# EAGLE schematic mysch_full (EAGLE 9.5.0)

## Sheet 1 of 3
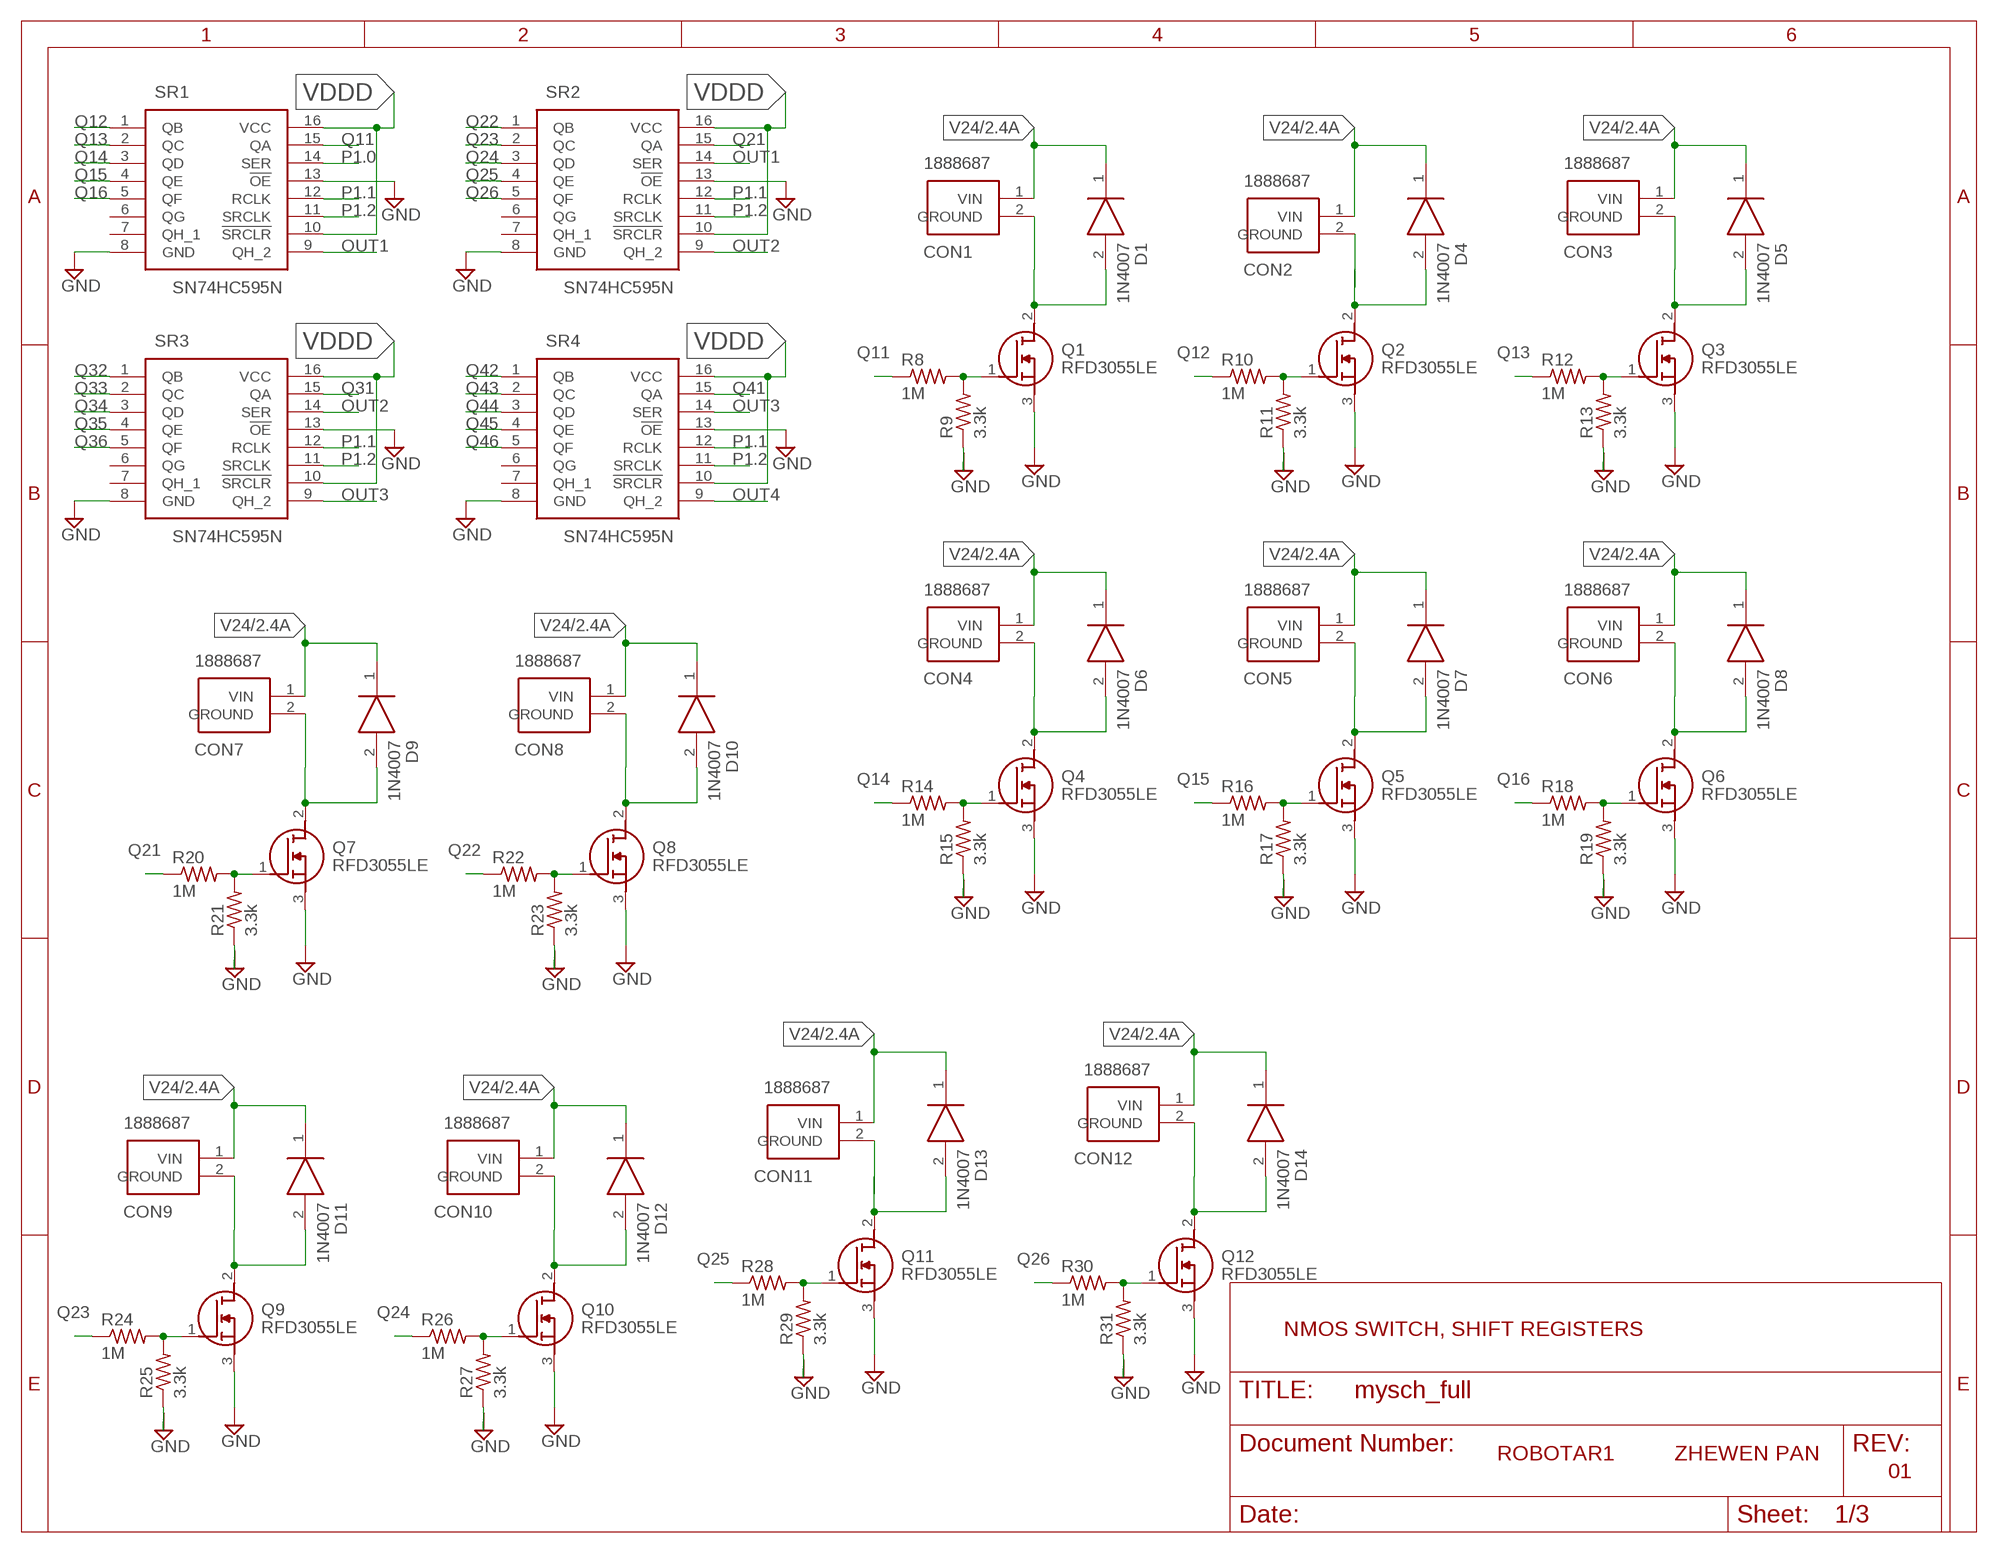
[diagram p0: schematic, sheet 1]

### Parts
CON1  1888687  [SHDR2W90P0X508_1X2_1016X950X15]
CON2  1888687  [SHDR2W90P0X508_1X2_1016X950X15]
CON3  1888687  [SHDR2W90P0X508_1X2_1016X950X15]
CON4  1888687  [SHDR2W90P0X508_1X2_1016X950X15]
CON5  1888687  [SHDR2W90P0X508_1X2_1016X950X15]
CON6  1888687  [SHDR2W90P0X508_1X2_1016X950X15]
CON7  1888687  [SHDR2W90P0X508_1X2_1016X950X15]
CON8  1888687  [SHDR2W90P0X508_1X2_1016X950X15]
CON9  1888687  [SHDR2W90P0X508_1X2_1016X950X15]
CON10  1888687  [SHDR2W90P0X508_1X2_1016X950X15]
CON11  1888687  [SHDR2W90P0X508_1X2_1016X950X15]
CON12  1888687  [SHDR2W90P0X508_1X2_1016X950X15]
D1  1N4007  [DIOAD1410W86L470D235]
D4  1N4007  [DIOAD1410W86L470D235]
D5  1N4007  [DIOAD1410W86L470D235]
D6  1N4007  [DIOAD1410W86L470D235]
D7  1N4007  [DIOAD1410W86L470D235]
D8  1N4007  [DIOAD1410W86L470D235]
D9  1N4007  [DIOAD1410W86L470D235]
D10  1N4007  [DIOAD1410W86L470D235]
D11  1N4007  [DIOAD1410W86L470D235]
D12  1N4007  [DIOAD1410W86L470D235]
D13  1N4007  [DIOAD1410W86L470D235]
D14  1N4007  [DIOAD1410W86L470D235]
Q1  RFD3055LE  [TO229P250X658X985-3P]
Q2  RFD3055LE  [TO229P250X658X985-3P]
Q3  RFD3055LE  [TO229P250X658X985-3P]
Q4  RFD3055LE  [TO229P250X658X985-3P]
Q5  RFD3055LE  [TO229P250X658X985-3P]
Q6  RFD3055LE  [TO229P250X658X985-3P]
Q7  RFD3055LE  [TO229P250X658X985-3P]
Q8  RFD3055LE  [TO229P250X658X985-3P]
Q9  RFD3055LE  [TO229P250X658X985-3P]
Q10  RFD3055LE  [TO229P250X658X985-3P]
Q11  RFD3055LE  [TO229P250X658X985-3P]
Q12  RFD3055LE  [TO229P250X658X985-3P]
R8  1M  R-US_R0805  [R0805]
R9  3.3k  R-US_R0805  [R0805]
R10  1M  R-US_R0805  [R0805]
R11  3.3k  R-US_R0805  [R0805]
R12  1M  R-US_R0805  [R0805]
R13  3.3k  R-US_R0805  [R0805]
R14  1M  R-US_R0805  [R0805]
R15  3.3k  R-US_R0805  [R0805]
R16  1M  R-US_R0805  [R0805]
R17  3.3k  R-US_R0805  [R0805]
R18  1M  R-US_R0805  [R0805]
R19  3.3k  R-US_R0805  [R0805]
R20  1M  R-US_R0805  [R0805]
R21  3.3k  R-US_R0805  [R0805]
R22  1M  R-US_R0805  [R0805]
R23  3.3k  R-US_R0805  [R0805]
R24  1M  R-US_R0805  [R0805]
R25  3.3k  R-US_R0805  [R0805]
R26  1M  R-US_R0805  [R0805]
R27  3.3k  R-US_R0805  [R0805]
R28  1M  R-US_R0805  [R0805]
R29  3.3k  R-US_R0805  [R0805]
R30  1M  R-US_R0805  [R0805]
R31  3.3k  R-US_R0805  [R0805]
SR1  SN74HC595N  [DIP794W53P254L1930H508Q16N]
SR2  SN74HC595N  [DIP794W53P254L1930H508Q16N]
SR3  SN74HC595N  [DIP794W53P254L1930H508Q16N]
SR4  SN74HC595N  [DIP794W53P254L1930H508Q16N]

### Nets
GND: Q1.3(S) Q2.3(S) Q3.3(S) Q4.3(S) Q5.3(S) Q6.3(S) Q7.3(S) Q8.3(S) Q9.3(S) Q10.3(S) Q11.3(S) Q12.3(S) R9.1 R11.1 R13.1 R15.1 R17.1 R19.1 R21.1 R23.1 R25.1 R27.1 R29.1 R31.1 SR1.8(GND) SR1.13(!OE) SR2.8(GND) SR2.13(!OE) SR3.8(GND) SR3.13(!OE) SR4.8(GND) SR4.13(!OE) ; also sheet 2,3
N$6: Q1.1(G) R8.2 R9.2
N$7: CON1.2(GROUND) D1.2(A) Q1.2(D)
N$12: D4.2(A) Q2.2(D)
N$13: Q2.1(G) R10.2 R11.2
N$15: D5.2(A) Q3.2(D)
N$16: Q3.1(G) R12.2 R13.2
N$18: D6.2(A) Q4.2(D)
N$19: Q4.1(G) R14.2 R15.2
N$21: D7.2(A) Q5.2(D)
N$22: Q5.1(G) R16.2 R17.2
N$24: D8.2(A) Q6.2(D)
N$25: Q6.1(G) R18.2 R19.2
N$27: D9.2(A) Q7.2(D)
N$28: Q7.1(G) R20.2 R21.2
N$30: D10.2(A) Q8.2(D)
N$31: Q8.1(G) R22.2 R23.2
N$33: D11.2(A) Q9.2(D)
N$34: Q9.1(G) R24.2 R25.2
N$36: D12.2(A) Q10.2(D)
N$37: Q10.1(G) R26.2 R27.2
N$39: D13.2(A) Q11.2(D)
N$40: Q11.1(G) R28.2 R29.2
N$42: D14.2(A) Q12.2(D)
N$43: Q12.1(G) R30.2 R31.2
N$80: CON2.2(GROUND)
N$81: CON3.2(GROUND)
N$82: CON4.2(GROUND)
N$83: CON5.2(GROUND)
N$84: CON6.2(GROUND)
N$85: CON7.2(GROUND)
N$86: CON8.2(GROUND)
N$87: CON9.2(GROUND)
N$88: CON10.2(GROUND)
N$89: CON11.2(GROUND)
N$90: CON12.2(GROUND)
OUT1: SR1.9(QH_2) SR2.14(SER)
OUT2: SR2.9(QH_2) SR3.14(SER)
OUT3: SR3.9(QH_2) SR4.14(SER)
OUT4: SR4.9(QH_2)
P1.0: SR1.14(SER) ; also sheet 3
P1.1: SR1.12(RCLK) SR2.12(RCLK) SR3.12(RCLK) SR4.12(RCLK) ; also sheet 3
P1.2: SR1.11(SRCLK) SR2.11(SRCLK) SR3.11(SRCLK) SR4.11(SRCLK) ; also sheet 3
Q11: R8.1 SR1.15(QA)
Q12: R10.1 SR1.1(QB)
Q13: R12.1 SR1.2(QC)
Q14: R14.1 SR1.3(QD)
Q15: R16.1 SR1.4(QE)
Q16: R18.1 SR1.5(QF)
Q21: R20.1 SR2.15(QA)
Q22: R22.1 SR2.1(QB)
Q23: R24.1 SR2.2(QC)
Q24: R26.1 SR2.3(QD)
Q25: R28.1 SR2.4(QE)
Q26: R30.1 SR2.5(QF)
Q31: SR3.15(QA) ; also sheet 2
Q32: SR3.1(QB)
Q33: SR3.2(QC)
Q34: SR3.3(QD)
Q35: SR3.4(QE)
Q36: SR3.5(QF)
Q41: SR4.15(QA)
Q42: SR4.1(QB)
Q43: SR4.2(QC)
Q44: SR4.3(QD)
Q45: SR4.4(QE)
Q46: SR4.5(QF)
V1: CON2.1(VIN)
V2: CON3.1(VIN)
V3: CON4.1(VIN)
V4: CON5.1(VIN)
V5: CON6.1(VIN)
V6: CON7.1(VIN)
V7: CON8.1(VIN)
V8: CON9.1(VIN)
V9: CON10.1(VIN)
V10: CON11.1(VIN)
V11: CON12.1(VIN)
V24: CON1.1(VIN) D1.1(K) D4.1(K) D5.1(K) D6.1(K) D7.1(K) D8.1(K) D9.1(K) D10.1(K) D11.1(K) D12.1(K) D13.1(K) D14.1(K) ; also sheet 2,3
VDDD: SR1.10(!SRCLR) SR1.16(VCC) SR2.10(!SRCLR) SR2.16(VCC) SR3.10(!SRCLR) SR3.16(VCC) SR4.10(!SRCLR) SR4.16(VCC)
Unconnected: SR1.6(QG) SR1.7(QH_1) SR2.6(QG) SR2.7(QH_1) SR3.6(QG) SR3.7(QH_1) SR4.6(QG) SR4.7(QH_1)

### Notes on the sheet
- NMOS SWITCH, SHIFT REGISTERS
- ROBOTAR1 | ZHEWEN PAN
- 01

## Sheet 2 of 3
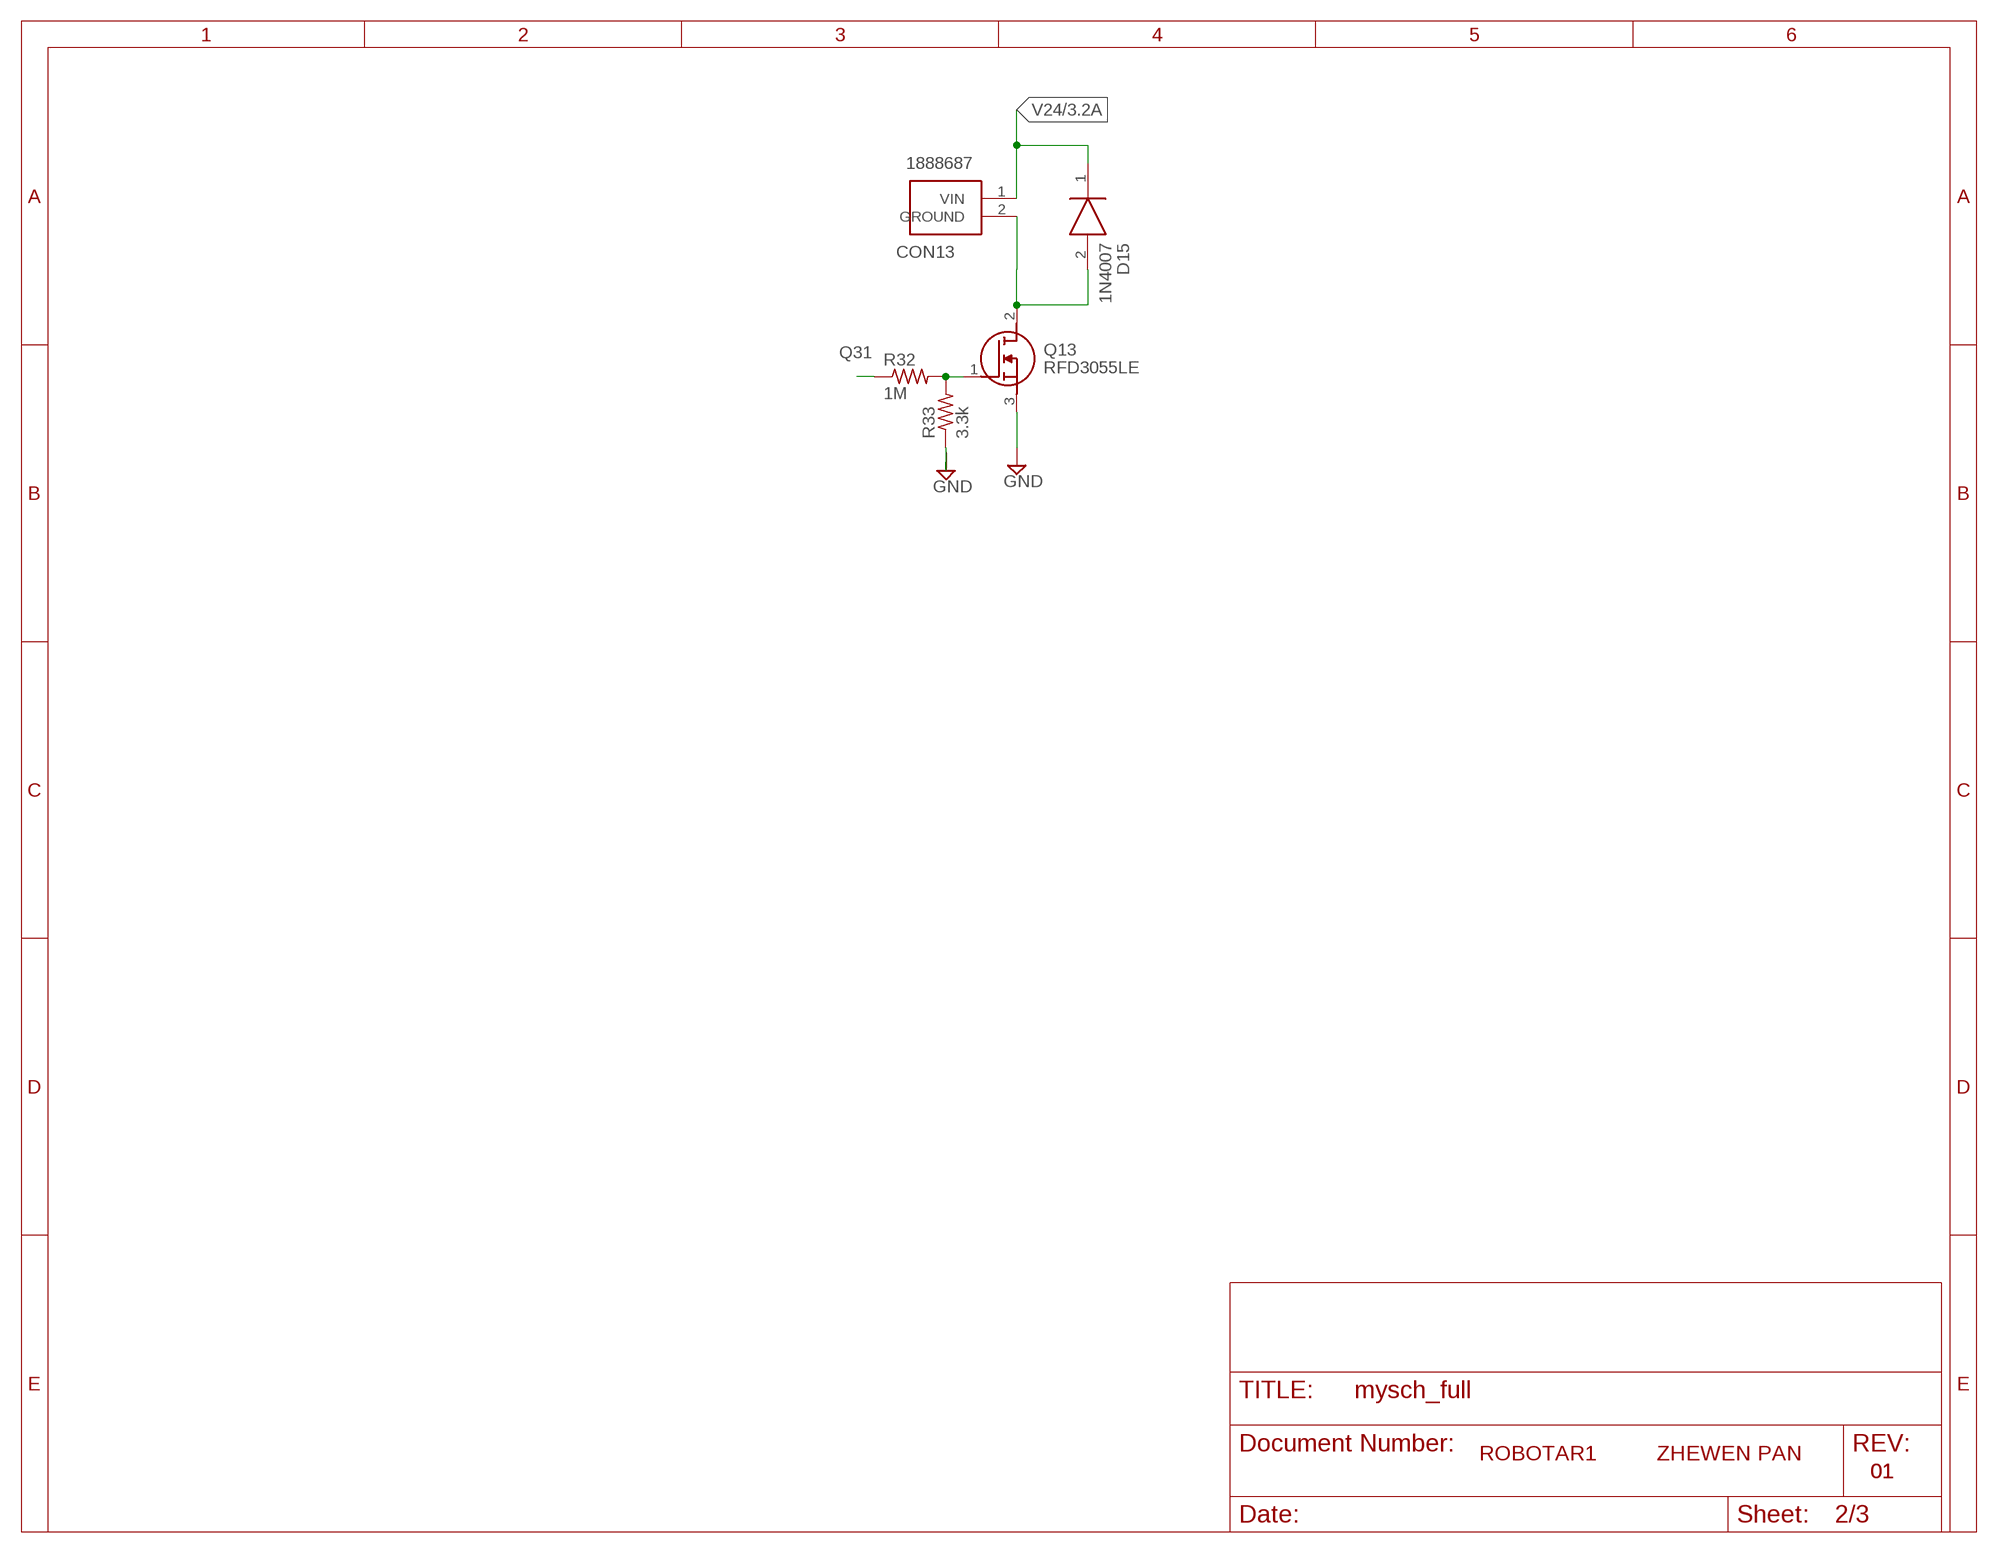
[diagram p1: schematic, sheet 2]

### Parts
CON13  1888687  [SHDR2W90P0X508_1X2_1016X950X15]
D15  1N4007  [DIOAD1410W86L470D235]
Q13  RFD3055LE  [TO229P250X658X985-3P]
R32  1M  R-US_R0805  [R0805]
R33  3.3k  R-US_R0805  [R0805]

### Nets
GND: Q13.3(S) R33.1 ; also sheet 1,3
N$9: D15.2(A) Q13.2(D)
N$45: Q13.1(G) R32.2 R33.2
N$91: CON13.2(GROUND)
Q31: R32.1 ; also sheet 1
V12: CON13.1(VIN)
V24: D15.1(K) ; also sheet 1,3

### Notes on the sheet
- ROBOTAR1 | ZHEWEN PAN
- 01 | 01

## Sheet 3 of 3
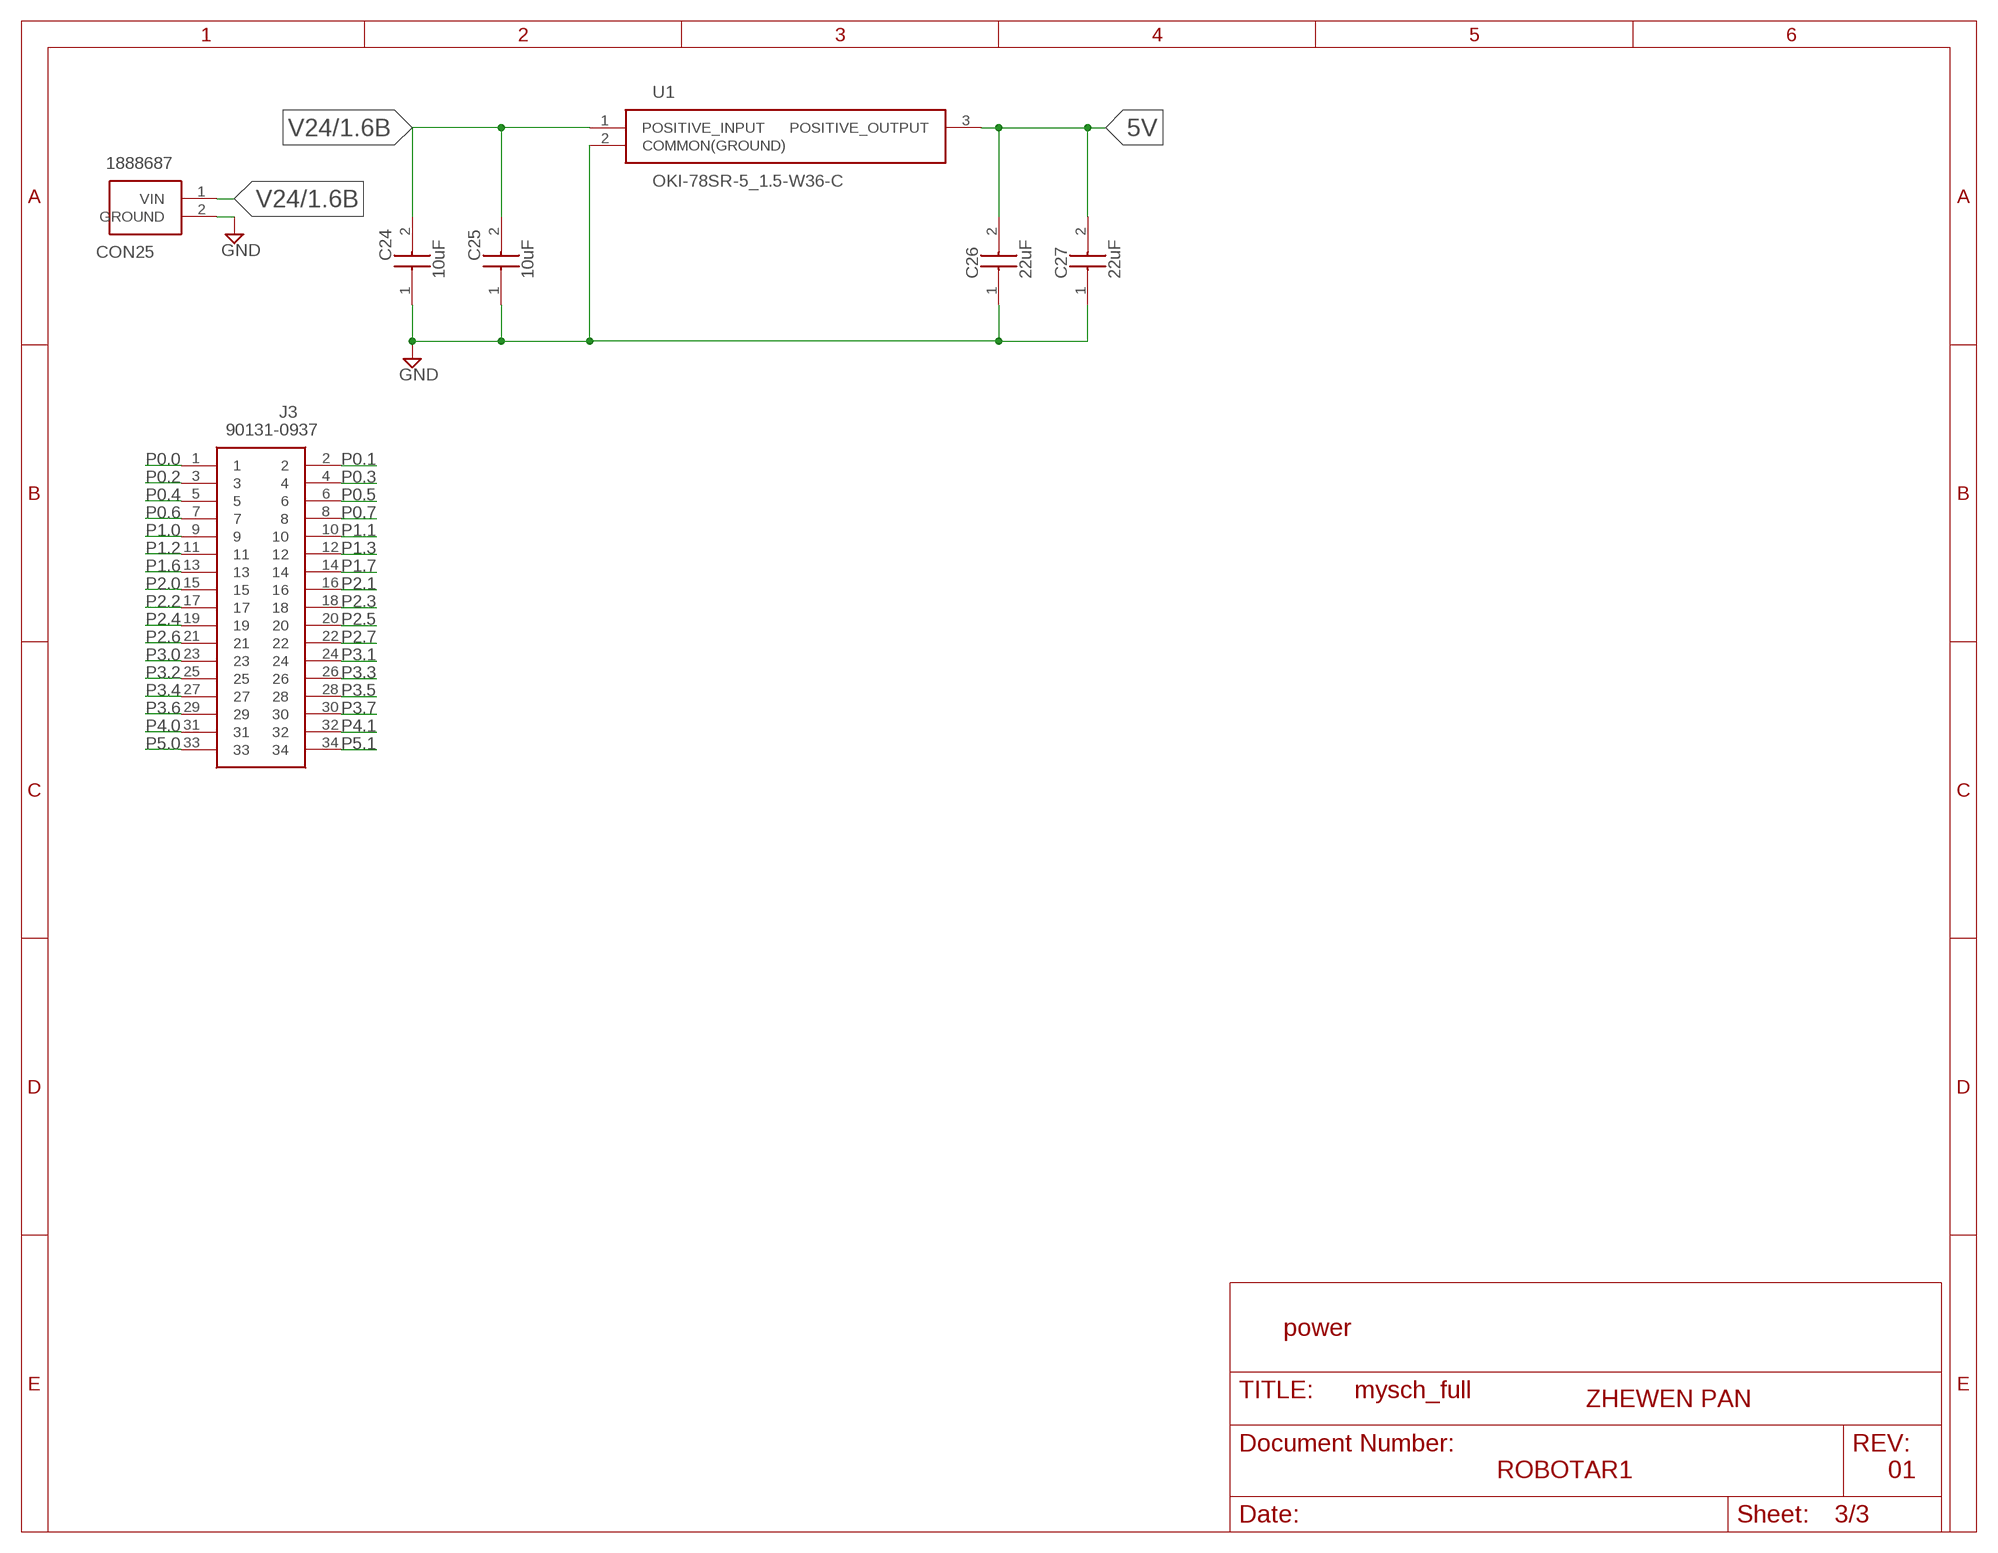
[diagram p2: schematic, sheet 3]

### Parts
C24  10uF  GRM32DF51H106ZA01K  [CAPC3225X220N]
C25  10uF  GRM32DF51H106ZA01K  [CAPC3225X220N]
C26  22uF  GRM32ER71E226KE15K  [CAPC3225X270N]
C27  22uF  GRM32ER71E226KE15K  [CAPC3225X270N]
CON25  1888687  [SHDR2W90P0X508_1X2_1016X950X15]
J3  90131-0937  [HDRV34W90P254_2X17_4308X500X56]
U1  OKI-78SR-5_1.5-W36-C  [OKI-78SR]

### Nets
5V: C26.2 C27.2 U1.3(POSITIVE_OUTPUT)
GND: C24.1 C25.1 C26.1 C27.1 CON25.2(GROUND) U1.2(COMMON(GROUND)) ; also sheet 1,2
P0.0: J3.1
P0.1: J3.2
P0.2: J3.3
P0.3: J3.4
P0.4: J3.5
P0.5: J3.6
P0.6: J3.7
P0.7: J3.8
P1.0: J3.9 ; also sheet 1
P1.1: J3.10 ; also sheet 1
P1.2: J3.11 ; also sheet 1
P1.3: J3.12
P1.6: J3.13
P1.7: J3.14
P2.0: J3.15
P2.1: J3.16
P2.2: J3.17
P2.3: J3.18
P2.4: J3.19
P2.5: J3.20
P2.6: J3.21
P2.7: J3.22
P3.0: J3.23
P3.1: J3.24
P3.2: J3.25
P3.3: J3.26
P3.4: J3.27
P3.5: J3.28
P3.6: J3.29
P3.7: J3.30
P4.0: J3.31
P4.1: J3.32
P5.0: J3.33
P5.1: J3.34
V24: C24.2 C25.2 CON25.1(VIN) U1.1(POSITIVE_INPUT) ; also sheet 1,2

### Notes on the sheet
- power
- ZHEWEN PAN
- ROBOTAR1 | 01

## Library data of the parts
C24 C25 = SamacSys_Parts:GRM32DF51H106ZA01K: Multilayer Ceramic Capacitors MLCC - SMD/SMT 10uF 50Volts -20% to 80% Source: Datasheet <http://www.murata.com/~/media/webrenewal/support/library/catalog/products/capacitor/mlcc/c02e.pdf>; DESCRIPTION: Multilayer Ceramic Capacitors MLCC - SMD/SMT 10uF 50Volts -20% to 80%; HEIGHT: 2.2mm; MANUFACTURER_NAME: Murata Electronics; MANUFACTURER_PART_NUMBER: GRM32DF51H106ZA01K
C26 C27 = SamacSys_Parts:GRM32ER71E226KE15K: Multilayer Ceramic Capacitors MLCC - SMD/SMT 22UF 25V 10% 1210 Source: Datasheet <http://psearch.en.murata.com/capacitor/product/GRM32ER71E226KE15#.pdf>; DESCRIPTION: Multilayer Ceramic Capacitors MLCC - SMD/SMT 22UF 25V 10% 1210; HEIGHT: 2.7mm; MANUFACTURER_NAME: Murata Electronics; MANUFACTURER_PART_NUMBER: GRM32ER71E226KE15K
CON1-CON13 CON25 = SamacSys_Parts:1888687: Phoenix Contact COMBICON MKDSN Series 5.08mm Pitch Straight PCB Terminal Block with Screw Termination, Through Hole Source: Datasheet <http://uk.rs-online.com/web/p/products/8045095>; ALLIED_NUMBER: 70054422; DESCRIPTION: Phoenix Contact COMBICON MKDSN Series 5.08mm Pitch Straight PCB Terminal Block with Screw Termination, Through Hole; HEIGHT: 15mm; MANUFACTURER_NAME: Phoenix Contact; MANUFACTURER_PART_NUMBER: 1888687; RS_PART_NUMBER: 8045095; RS_PRICE-STOCK: http://uk.rs-online.com/web/p/products/8045095
D1 D4-D15 = SamacSys_Parts:1N4007: MULTICOMP - 1N4007 - DIODE, STANDARD, 1A, 1000V,DO-41 Source: Datasheet; DESCRIPTION: MULTICOMP - 1N4007 - DIODE, STANDARD, 1A, 1000V,DO-41; HEIGHT: mm; MANUFACTURER_NAME: MULTICOMP; MANUFACTURER_PART_NUMBER: 1N4007
J3 = 90131-0937:90131-0937: Molex C-GRID III Series, Series Number 90131, 2.54mm Pitch 34 Way 2 Row Straight PCB Header, Solder Termination, 3A Source: Datasheet <http://uk.rs-online.com/web/p/products/6703569>; ALLIED_NUMBER: 70373750; DESCRIPTION: Molex C-GRID III Series, Series Number 90131, 2.54mm Pitch 34 Way 2 Row Straight PCB Header, Solder Termination, 3A; HEIGHT: 5.6mm; MANUFACTURER_NAME: Molex; MANUFACTURER_PART_NUMBER: 90131-0937; RS_PART_NUMBER: 6703569; RS_PRICE-STOCK: http://uk.rs-online.com/web/p/products/6703569
Q1-Q13 = SamacSys_Parts:RFD3055LE: ON SEMICONDUCTOR - RFD3055LE - MOSFET, N-CH, 60V, 11A, TO-251AA-3 Source: Datasheet <https://www.onsemi.com/pub/Collateral/RFD3055LESM-D.pdf>; DESCRIPTION: ON SEMICONDUCTOR - RFD3055LE - MOSFET, N-CH, 60V, 11A, TO-251AA-3; HEIGHT: 2.5mm; MANUFACTURER_NAME: ON Semiconductor; MANUFACTURER_PART_NUMBER: RFD3055LE
R8-R33 = rcl:R-US_: RESISTOR, American symbol; SPICEPREFIX: R
SR1-SR4 = SamacSys_Parts:SN74HC595N: 8-Bit Shift Registers With 3-State Output Registers Source: Datasheet <http://uk.rs-online.com/web/p/products/2175695P>; DESCRIPTION: 8-Bit Shift Registers With 3-State Output Registers; HEIGHT: 5.08mm; MANUFACTURER_NAME: Texas Instruments; MANUFACTURER_PART_NUMBER: SN74HC595N; RS_PART_NUMBER: 2175695P; RS_PRICE-STOCK: http://uk.rs-online.com/web/p/products/2175695P
U1 = SamacSys_Parts:OKI-78SR-5_1.5-W36-C: Non-Isolated DC/DC Converters 7.5W 24Vin 5Vout1 1.5A SIP Non-Iso Source: Datasheet <http://uk.rs-online.com/web/p/products/7962132P>; DESCRIPTION: Non-Isolated DC/DC Converters 7.5W 24Vin 5Vout1 1.5A SIP Non-Iso; HEIGHT: mm; MANUFACTURER_NAME: Murata Electronics; MANUFACTURER_PART_NUMBER: OKI-78SR-5/1.5-W36-C; RS_PART_NUMBER: 7962132P; RS_PRICE-STOCK: http://uk.rs-online.com/web/p/products/7962132P